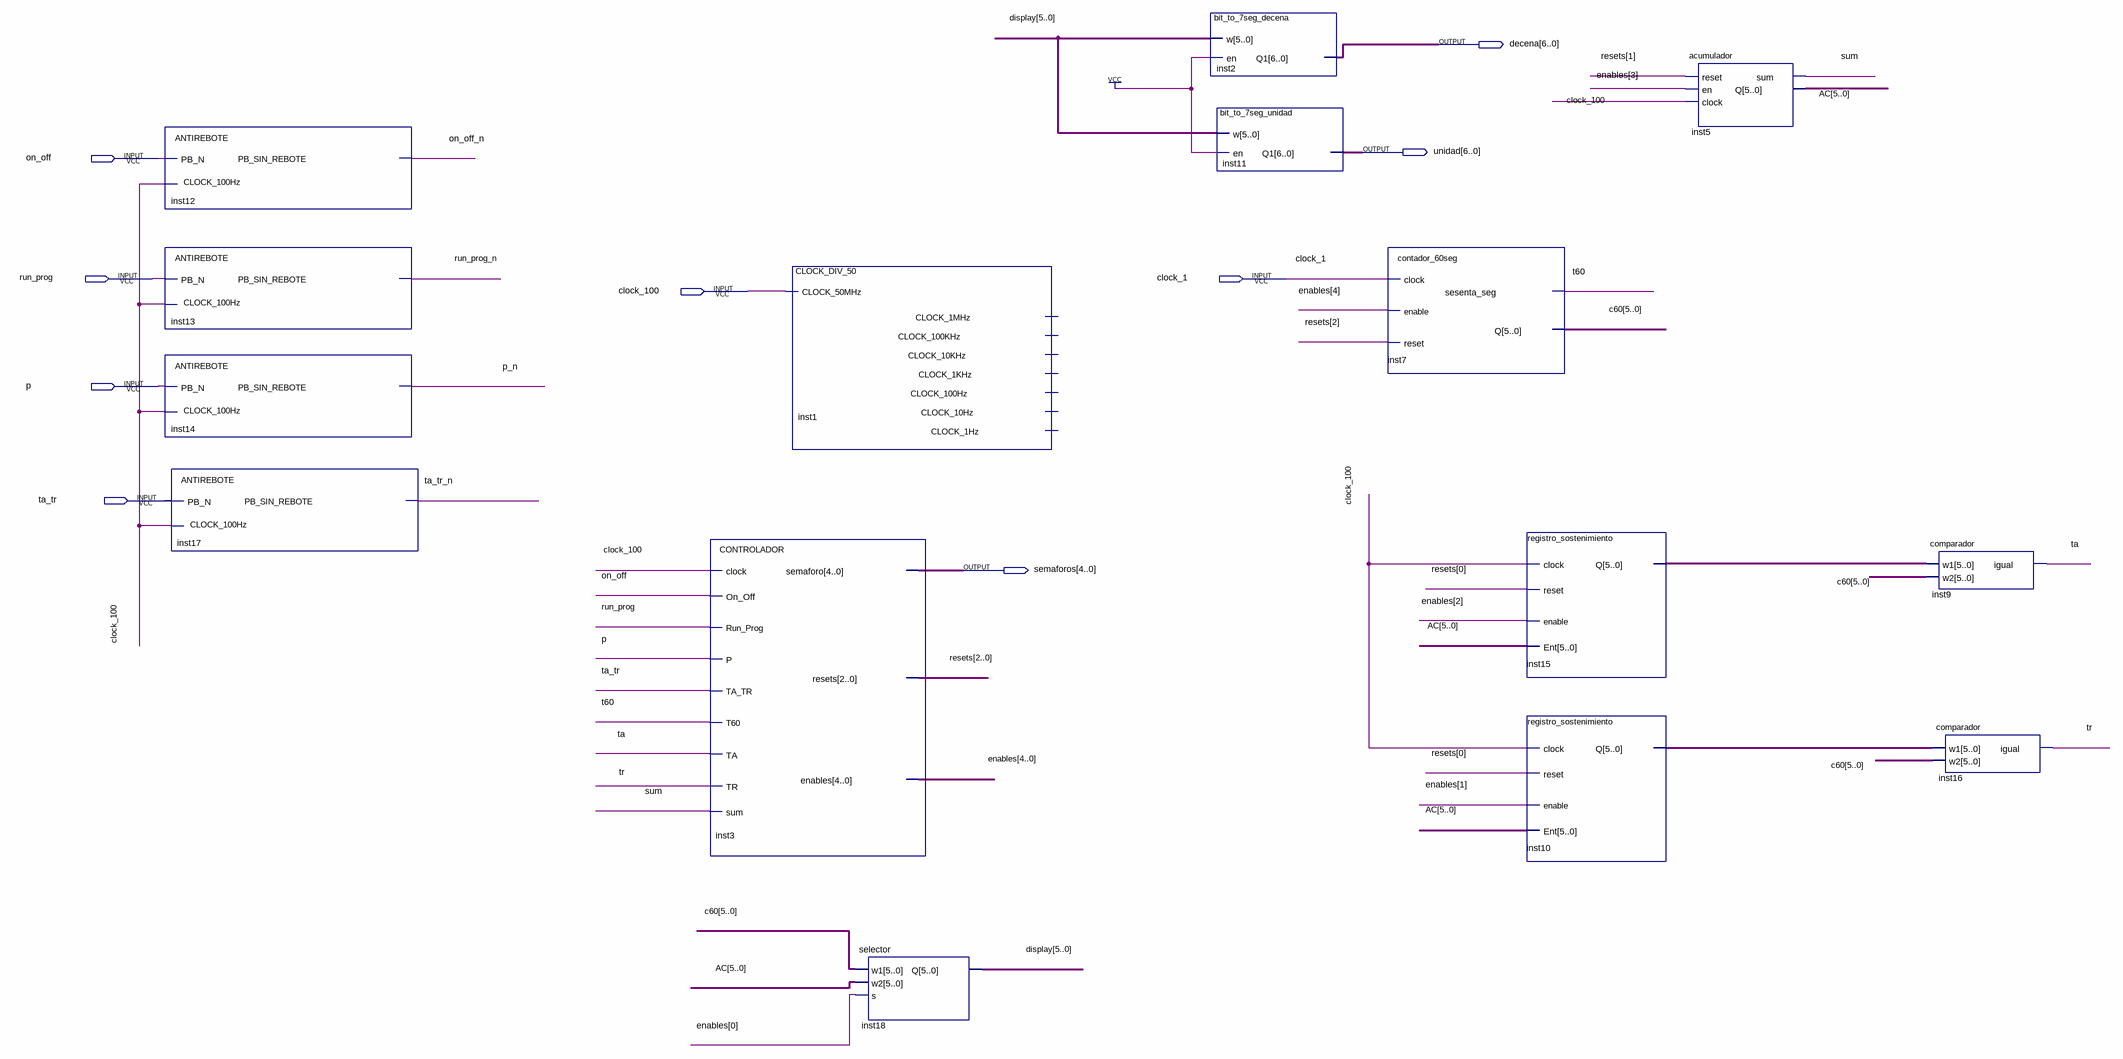
[diagram p0: schematic sheet]
// Quartus schematic bloques.bdf as structural Verilog: 15 symbols, 9 pins
module bloques (
  input  on_off,
  input  run_prog,
  input  clock_1,
  input  clock_100,
  input  p,
  input  ta_tr,
  output [6:0] decena,
  output [6:0] unidad,
  output [4:0] semaforos
);

  wire on_off_n, p_n, run_prog_n, sum, t60, ta, ta_tr_n, tr;
  wire [2:0] resets;
  wire [4:0] enables;
  wire [5:0] AC, c60, display, inst10_q, inst15_q;

  ANTIREBOTE inst12 (.PB_N(on_off), .CLOCK_100Hz(clock_100), .PB_SIN_REBOTE(on_off_n));
  ANTIREBOTE inst13 (.PB_N(run_prog), .CLOCK_100Hz(clock_100), .PB_SIN_REBOTE(run_prog_n));
  ANTIREBOTE inst14 (.PB_N(p), .CLOCK_100Hz(clock_100), .PB_SIN_REBOTE(p_n));
  ANTIREBOTE inst17 (.PB_N(ta_tr), .CLOCK_100Hz(clock_100), .PB_SIN_REBOTE(ta_tr_n));
  CONTROLADOR inst3 (
    .clock(clock_100), .On_Off(on_off), .Run_Prog(run_prog), .P(p), .TA_TR(ta_tr), .T60(t60), .TA(ta),
    .TR(tr), .sum(sum), .semaforo(semaforos), .resets(resets), .enables(enables));
  CLOCK_DIV_50 inst1 (.CLOCK_50MHz(clock_100));  // open: CLOCK_1MHz, CLOCK_100KHz, CLOCK_10KHz, CLOCK_1KHz, CLOCK_100Hz, CLOCK_10Hz, CLOCK_1Hz
  selector inst18 (.w1(c60), .w2(AC), .s(enables[0]), .Q(display));
  bit_to_7seg_decena inst2 (.w(display), .en(1'b1), .Q1(decena));
  bit_to_7seg_unidad inst11 (.w(display), .en(1'b1), .Q1(unidad));
  contador_60seg inst7 (.clock(clock_1), .enable(enables[4]), .reset(resets[2]), .sesenta_seg(t60), .Q(c60));
  registro_sostenimiento inst15 (.clock(clock_100), .reset(resets[0]), .enable(enables[2]), .Ent(AC), .Q(inst15_q));
  registro_sostenimiento inst10 (.clock(clock_100), .reset(resets[0]), .enable(enables[1]), .Ent(AC), .Q(inst10_q));
  acumulador inst5 (.reset(resets[1]), .en(enables[3]), .clock(clock_100), .sum(sum), .Q(AC));
  comparador inst9 (.w1(inst15_q), .w2(c60), .igual(ta));
  comparador inst16 (.w1(inst10_q), .w2(c60), .igual(tr));
endmodule
